# Altium schematic sheet custom_line_V1_mux1.SchDoc
size 209 x 297 mm
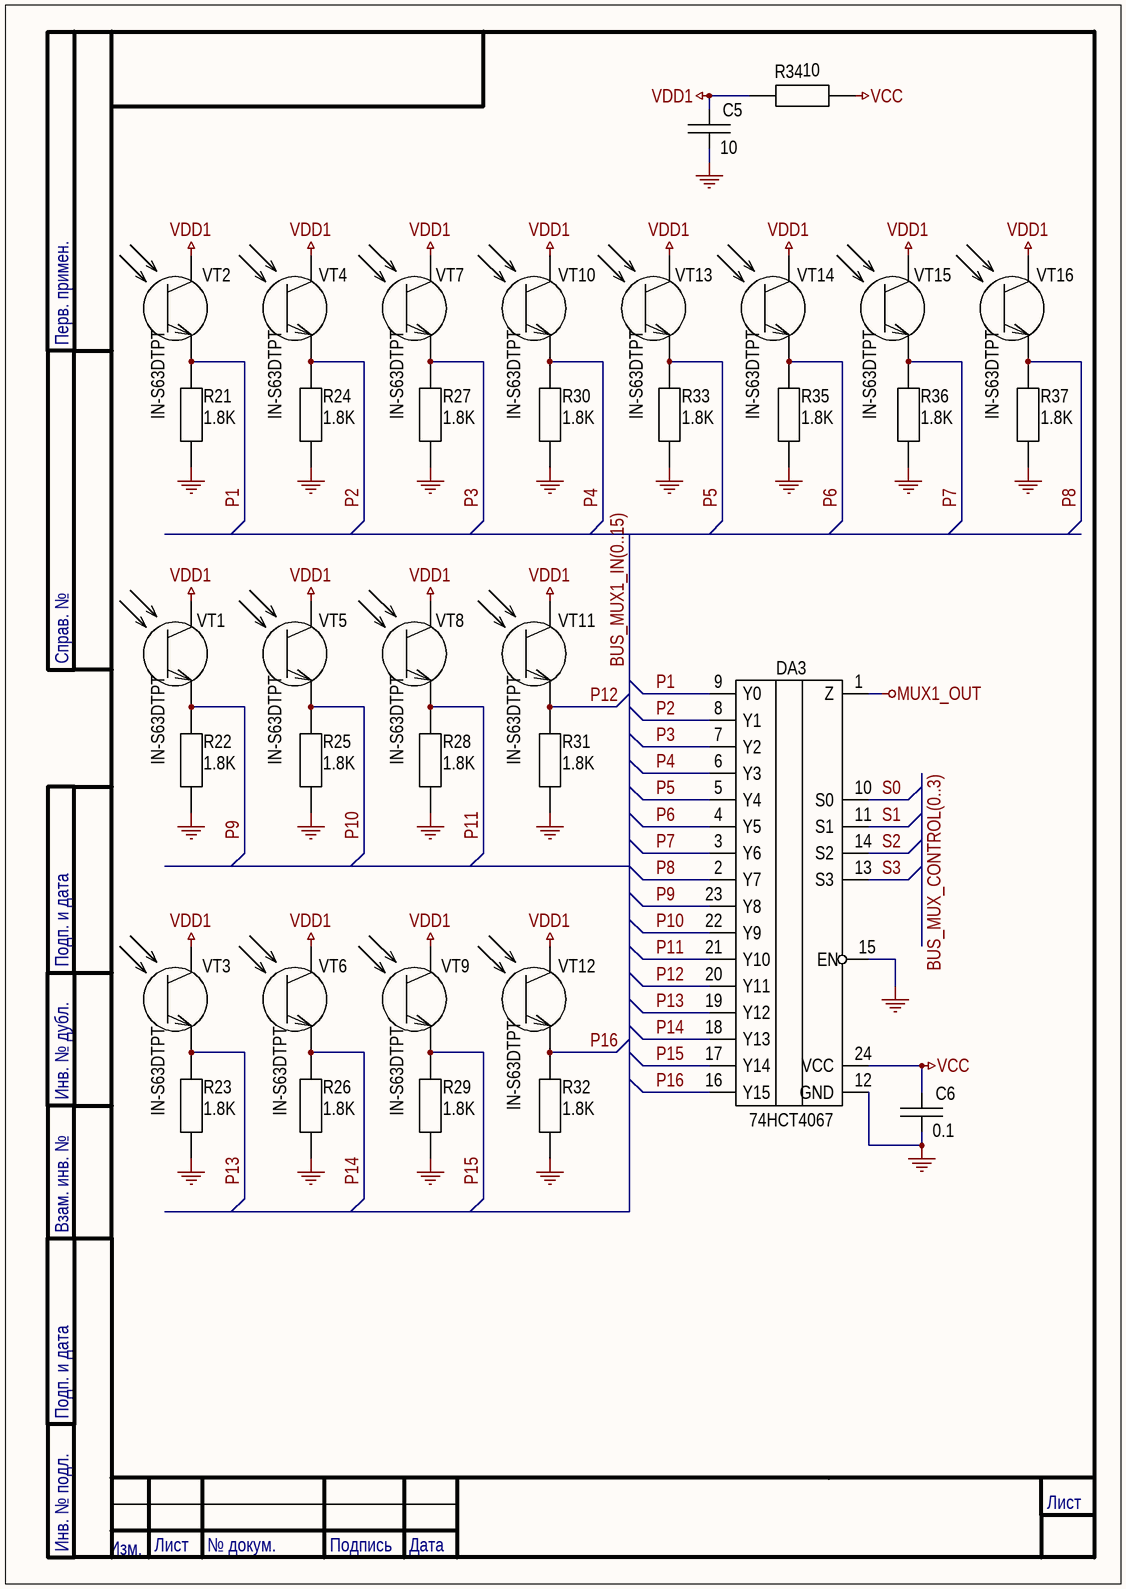
[diagram p0: custom_line_V1_mux1.SchDoc]

## Parts
C5  10  [CC_0805]
C6  0.1  [CC_0603]
DA3  74HC4067  [TSSOP-24]  (value not drawn)
R21  1.8K  [RC_0603_SMALL]
R22  1.8K  [RC_0603_SMALL]
R23  1.8K  [RC_0603_SMALL]
R24  1.8K  [RC_0603_SMALL]
R25  1.8K  [RC_0603_SMALL]
R26  1.8K  [RC_0603_SMALL]
R27  1.8K  [RC_0603_SMALL]
R28  1.8K  [RC_0603_SMALL]
R29  1.8K  [RC_0603_SMALL]
R30  1.8K  [RC_0603_SMALL]
R31  1.8K  [RC_0603_SMALL]
R32  1.8K  [RC_0603_SMALL]
R33  1.8K  [RC_0603_SMALL]
R34  10  [RC_0603_SMALL]
R35  1.8K  [RC_0603_SMALL]
R36  1.8K  [RC_0603_SMALL]
R37  1.8K  [RC_0603_SMALL]
VT1  IN-S63DTPT  [LED_0603]
VT2  IN-S63DTPT  [LED_0603]
VT3  IN-S63DTPT  [LED_0603]
VT4  IN-S63DTPT  [LED_0603]
VT5  IN-S63DTPT  [LED_0603]
VT6  IN-S63DTPT  [LED_0603]
VT7  IN-S63DTPT  [LED_0603]
VT8  IN-S63DTPT  [LED_0603]
VT9  IN-S63DTPT  [LED_0603]
VT10  IN-S63DTPT  [LED_0603]
VT11  IN-S63DTPT  [LED_0603]
VT12  IN-S63DTPT  [LED_0603]
VT13  IN-S63DTPT  [LED_0603]
VT14  IN-S63DTPT  [LED_0603]
VT15  IN-S63DTPT  [LED_0603]
VT16  IN-S63DTPT  [LED_0603]

## Nets
GND: C5.1 C6.1 DA3.12(GND) DA3.15(EN) R21.1 R22.1 R23.1 R24.1 R25.1 R26.1 R27.1 R28.1 R29.1 R30.1 R31.1 R32.1 R33.1 R35.1 R36.1 R37.1
MUX1_OUT: DA3.1(Z)
VCC: C6.2 DA3.24(VCC) R34.1
VDD1: C5.2 R34.2 VT1.1(C) VT2.1(C) VT3.1(C) VT4.1(C) VT5.1(C) VT6.1(C) VT7.1(C) VT8.1(C) VT9.1(C) VT10.1(C) VT11.1(C) VT12.1(C) VT13.1(C) VT14.1(C) VT15.1(C) VT16.1(C)
P1: DA3.9(Y0) R21.2 VT2.2(E)
P2: DA3.8(Y1) R24.2 VT4.2(E)
P3: DA3.7(Y2) R27.2 VT7.2(E)
P4: DA3.6(Y3) R30.2 VT10.2(E)
P5: DA3.5(Y4) R33.2 VT13.2(E)
P6: DA3.4(Y5) R35.2 VT14.2(E)
P7: DA3.3(Y6) R36.2 VT15.2(E)
P8: DA3.2(Y7) R37.2 VT16.2(E)
P9: DA3.23(Y8) R22.2 VT1.2(E)
P10: DA3.22(Y9) R25.2 VT5.2(E)
P11: DA3.21(Y10) R28.2 VT8.2(E)
P12: DA3.20(Y11) R31.2 VT11.2(E)
P13: DA3.19(Y12) R23.2 VT3.2(E)
P14: DA3.18(Y13) R26.2 VT6.2(E)
P15: DA3.17(Y14) R29.2 VT9.2(E)
P16: DA3.16(Y15) R32.2 VT12.2(E)
S0: DA3.10(S0)
S1: DA3.11(S1)
S2: DA3.14(S2)
S3: DA3.13(S3)

## Buses and harness runs
bus BUS_MUX1_IN(0..15)
bus BUS_MUX_CONTROL(0..3)

## Notes on the sheet
- Перв. примен.
- Справ. №
- Подп. и дата
- Инв. № дубл.
- Взам. инв. №
- Изм.
- Лист
- Инв. № подл.
- № докум.
- Подпись
- Дата

## Library data of the parts
C5 = C: type: CC-0805-106-16V-X7R-10%; value: 10uF
C6 = C: type: CC-0603-B-104-K-50; value: 0.1uF
DA3 = 74HCT4067: 74HC4067PW; type: 74HCT4067
R21-R33 R35-R37 = R: power: 0.125W; value: 100K; type: RC-0603-104-5%
R34 = R: power: 0.125W; value: R10; type: RC-0603-R10-5%
VT1-VT16 = phototransistor: Phototransistor (Inolux); type: IN-S63DTPT